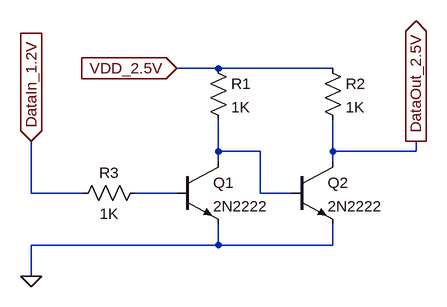
[diagram p0: schematic Draft1.asc]
Draft1.asc, the LTspice schematic file:
Version 4
SHEET 1 880 680
WIRE 240 224 176 224
WIRE 416 224 240 224
WIRE 240 352 240 304
WIRE 304 352 240 352
WIRE 416 352 416 304
WIRE 544 352 544 336
WIRE 544 352 416 352
WIRE 240 368 240 352
WIRE 416 368 416 352
WIRE -48 416 -48 336
WIRE 32 416 -48 416
WIRE 176 416 112 416
WIRE 304 416 304 352
WIRE 352 416 304 416
WIRE 240 496 240 464
WIRE 240 496 -48 496
WIRE 416 496 416 464
WIRE 416 496 240 496
WIRE -48 544 -48 496
FLAG -48 544 0
FLAG 176 224 VDD_2.5V
IOPIN 176 224 In
FLAG -48 336 DataIn_1.2V
IOPIN -48 336 In
FLAG 544 336 DataOut_2.5V
IOPIN 544 336 Out
SYMBOL res 224 208 R0
SYMATTR InstName R1
SYMATTR Value 1K
SYMBOL res 400 208 R0
SYMATTR InstName R2
SYMATTR Value 1K
SYMBOL res 128 400 R90
WINDOW 0 0 56 VBottom 2
WINDOW 3 32 56 VTop 2
SYMATTR InstName R3
SYMATTR Value 1K
SYMBOL npn 176 368 R0
SYMATTR InstName Q1
SYMATTR Value 2N2222
SYMBOL npn 352 368 R0
SYMATTR InstName Q2
SYMATTR Value 2N2222

The netlist it stands for:
* Draft1.asc
R1 VDD_2.5V N001 1K
R2 VDD_2.5V DataOut_2.5V 1K
R3 N002 DataIn_1.2V 1K
Q1 N001 N002 0 0 2N2222
Q2 DataOut_2.5V N001 0 0 2N2222
.model NPN NPN
.model PNP PNP
.lib standard.bjt
.backanno
.end